# Altium schematic sheet DSO_Power.SchDoc: Schematic_Name
size A4; CompanyName: University of Melbourne; Engineer: Your Name Here; DocumentNumber: 1; Revision: 0.1; SheetNumber: 1; SheetTotal: 1; Title_Project: Project_Title; StudentNo: Student No.
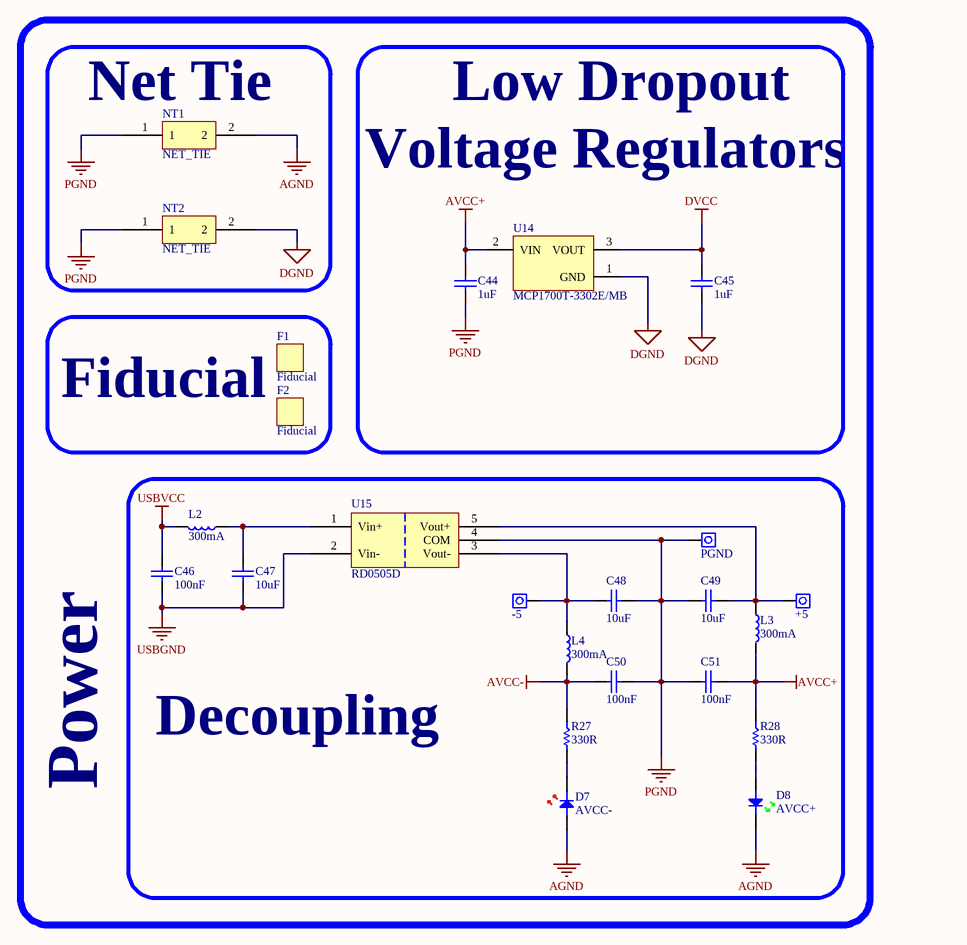
[diagram p0: DSO_Power.SchDoc]

## Parts
C44  1uF  [0805C]
C45  1uF  [0805C]
C46  100nF  [0805C]
C47  10uF  [0805C]
C48  10uF  [0805C]
C49  10uF  [0805C]
C50  100nF  [0805C]
C51  100nF  [0805C]
D7  AVCC-  [0805D-RED]
D8  AVCC+  [0805D-GREEN]
F1  Fiducial  [Fiducial]  (no BOM)
F2  Fiducial  [Fiducial]  (no BOM)
L2  300mA  [0805]
L3  300mA  [0805]
L4  300mA  [0805]
NT1  NET_TIE  [NET_TIE]  (net tie, no BOM)
NT2  NET_TIE  [NET_TIE]  (net tie, no BOM)
R27  330R  [0805]
R28  330R  [0805]
TP8  PGND  [PIN 1.8mm]
TP9  -5  [PIN 1.8mm]
TP10  +5  [PIN 1.8mm]
U14  MCP1700T-3302E/MB  [SOT89]
U15  RD0505D  [SIP_NMG]

## Blocks framed on the sheet
Power: C44 C45 U14
Net Tie: NT1 NT2
Fiducial: F1 F2
Decoupling: C46-C51 D7 D8 L2-L4 R27 R28 TP8-TP10 U15

## Nets
AGND: D7.A D8.K NT1.2
AVCC+: C44.2 C51.1 L3.2 R28.1 U14.2(VIN)
AVCC-: C50.2 L4.2 R27.1
DGND: C45.1 NT2.2 U14.1(GND)
DVCC: C45.2 U14.3(VOUT)
PGND: C44.1 C48.1 C49.2 C50.1 C51.2 NT1.1 NT2.1 TP8.1 U15.4(COM)
USBGND: C46.1 C47.1 U15.2(Vin-)
USBVCC: C46.2 L2.2
NetC47_2: C47.2 L2.1 U15.1(Vin+)
NetC48_2: C48.2 L4.1 TP9.1 U15.3(Vout-)
NetC49_1: C49.1 L3.1 TP10.1 U15.5(Vout+)
NetD7_K: D7.K R27.2
NetD8_A: D8.A R28.2

## Notes on the sheet
- Low Dropout
- Voltage Regulators

## Library data of the parts
C44-C51 = C: Capacitor; Reviewed by: RM - 2018/08/05; Revision: July-2002: Re-released for DXP Platform.; Supplier 1: *; Supplier Part Number 1: *
  C44 C45: Value: 1uF
  C46 C50 C51: Value: 100nF
  C47-C49: Value: 10uF
D7 = LED RED: Light Emitting Diode; Reviewed by: RM - 2018/08/05; Revision: July-2002: Re-released for DXP Platform.; Supplier 1: Digi-Key; Supplier Part Number 1: 475-1415-1-ND
D8 = LED GREEN: Light Emitting Diode; Reviewed by: RM - 2018/08/05; Revision: July-2002: Re-released for DXP Platform.; Supplier 1: Digi-Key; Supplier Part Number 1: 160-1423-1-ND
L2-L4 = I: Inductor; Reviewed by: RM - 2018/08/05; Supplier 1: *; Supplier Part Number 1: *; Value: 300mA
NT1 NT2 = NET_TIE: Net Tie
R27 R28 = R: Resistor; Reviewed by: RM - 2018/08/05; Value: 330R; Supplier 1: *; Suppler Part Number 1: *
TP8-TP10 = WIRE: Pad
U14 = MCP1700T: Low Quiescent Current LDO, 3-Pin SOT-89, Extended Temperature, Tape and Reel; Reviewed by: RM - 2018/08/05; Supplier 1: Digi-Key; Supplier Part Number 1: MCP1700T3302EMBCT-ND
U15 = RD0505D: (ADV) DC to DC converter 5V in +-5V out; Reviewed by: RM - 2018/08/05; Supplier Part Number 1: 945-1136-ND; Supplier 1: Digi-Key